# Altium schematic sheet DSP ADAU1451.SchDoc: BULLSEYE
size A3; CompanyName: TYMPHANY; DrawnBy: Yetta.He; Organization: PABU; Address1: 11F,block A, CEC building,; Address2: No.2070 Shennan Zhong road,; Address3: Huaqiang North, Futian District,; Address4: Shenzhen,  Guang Dong, P.R.C 518000; DocumentNumber: 5; Revision: 0.0.5; SheetNumber: 5; SheetTotal: 7; Size: A3; Status: DP1
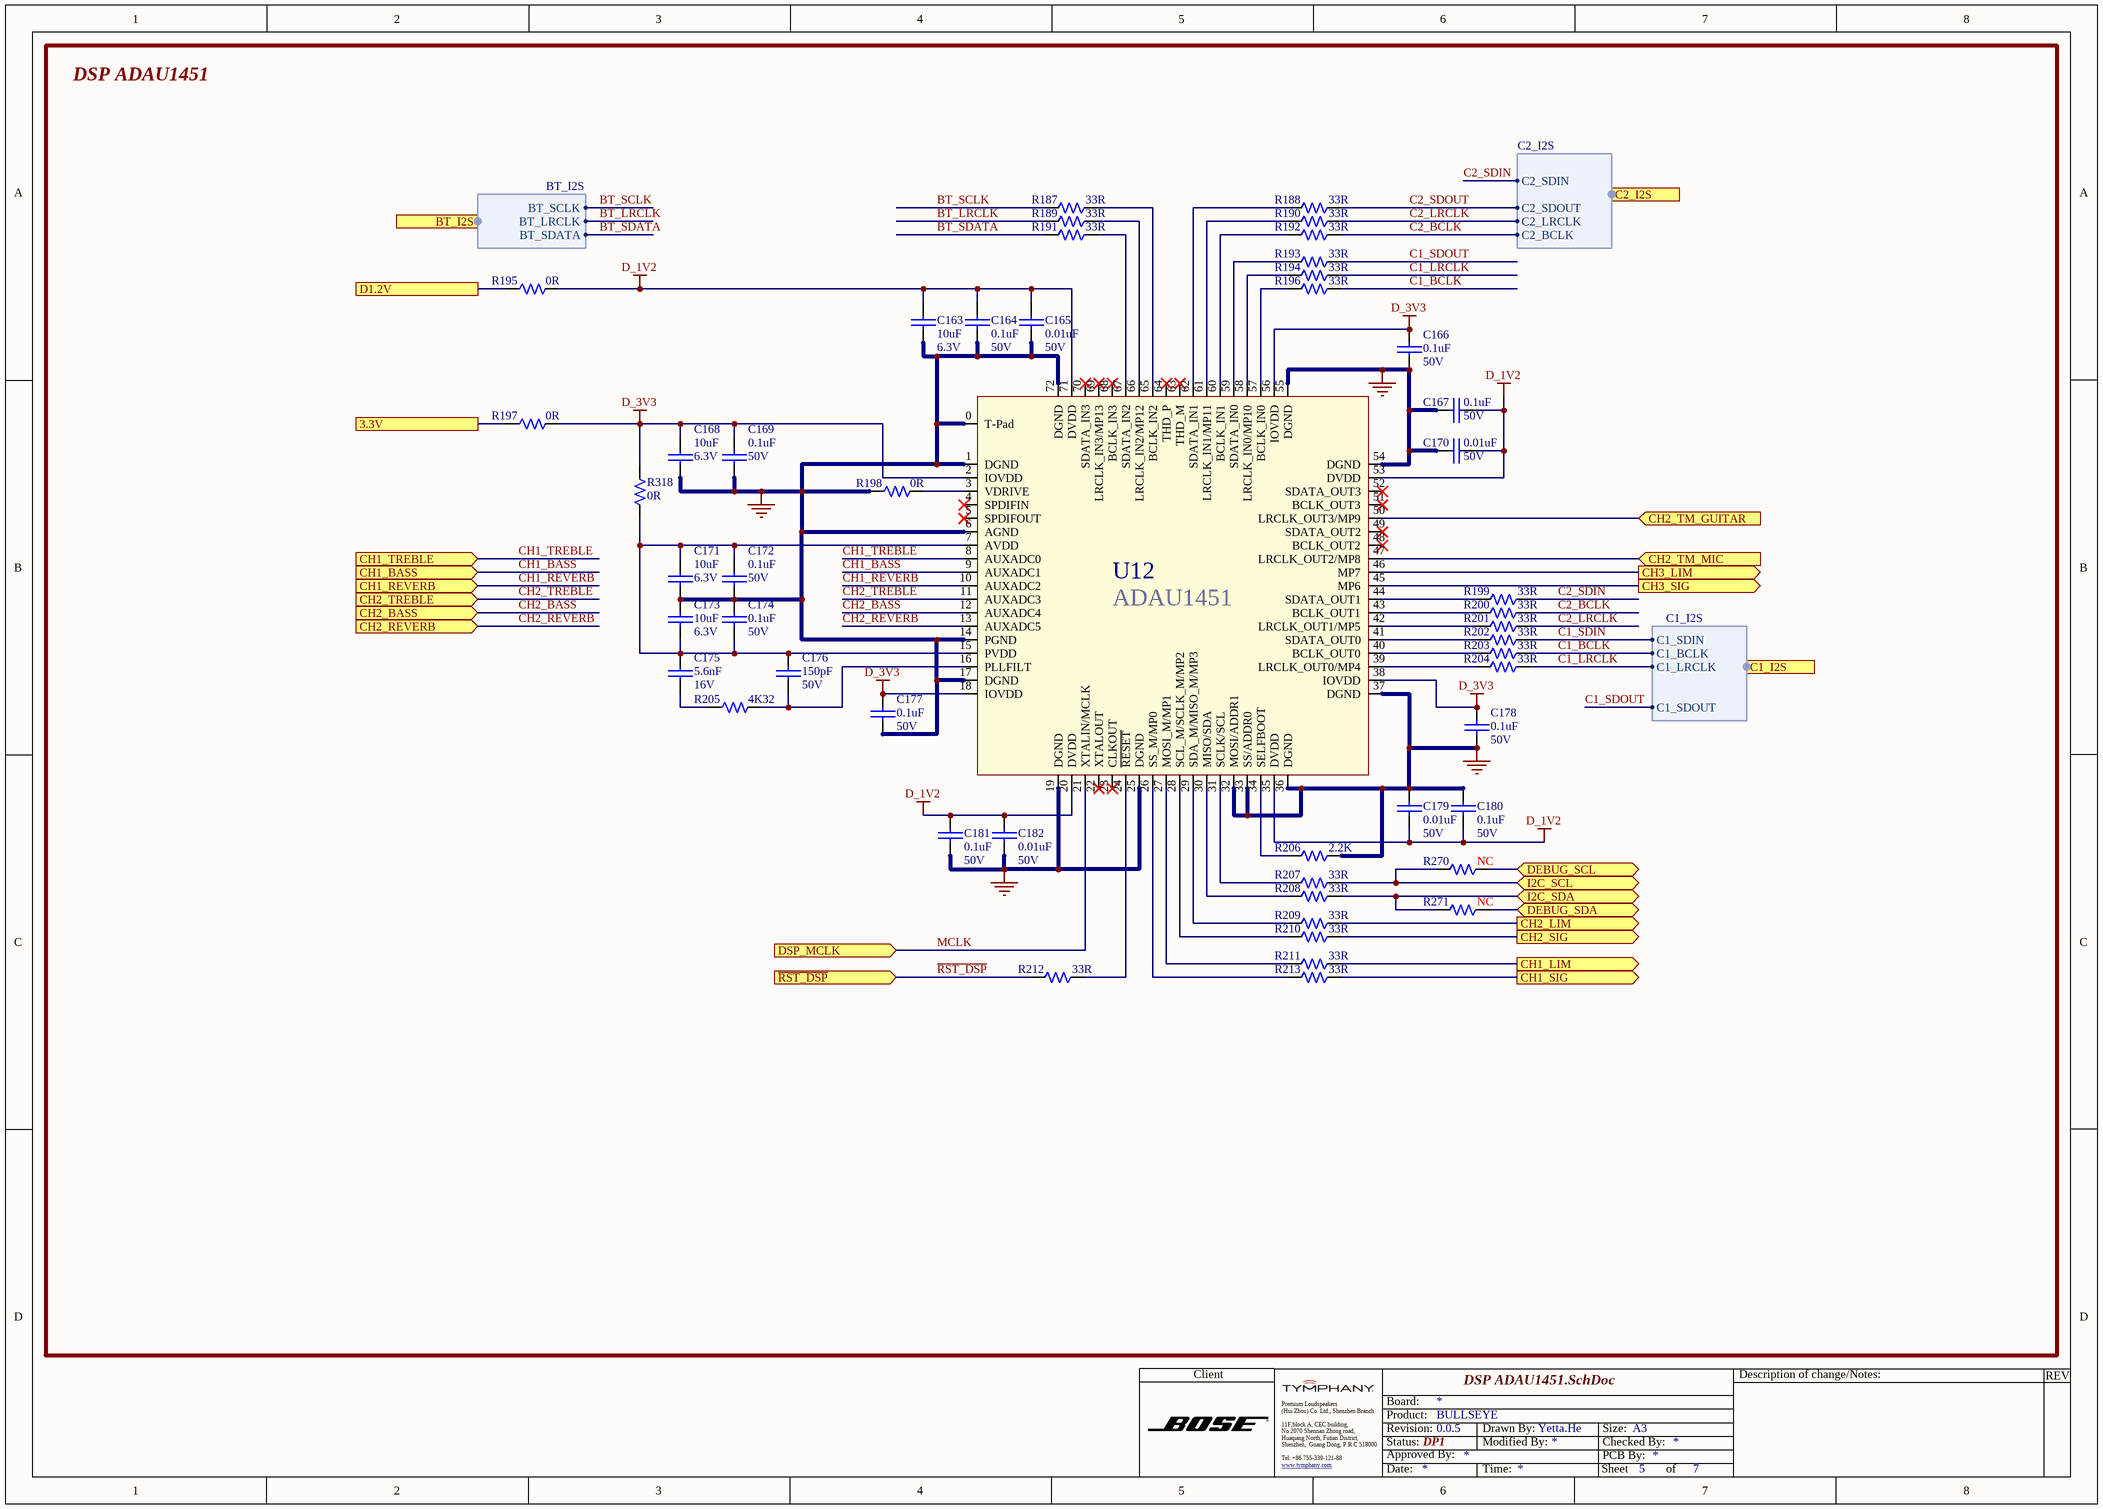
[diagram p0: DSP ADAU1451.SchDoc]

## Parts
C163  value 10uF  Voltage: 6.3V  [CAPC0603-RW]  (hidden comment: T54502106710E)
C164  value 0.1uF  Voltage: 50V  [CAPC0402-RW]  (hidden comment: PWL456470-1040)
C165  value 0.01uF  Voltage: 50V  [CAPC0402-RW]  (hidden comment: PWL456470-1030)
C166  value 0.1uF  Voltage: 50V  [CAPC0402-RW]  (hidden comment: PWL456470-1040)
C167  value 0.1uF  Voltage: 50V  [CAPC0402-RW]  (hidden comment: PWL456470-1040)
C168  value 10uF  Voltage: 6.3V  [CAPC0603-RW]  (hidden comment: T54502106710E)
C169  value 0.1uF  Voltage: 50V  [CAPC0402-RW]  (hidden comment: PWL456470-1040)
C170  value 0.01uF  Voltage: 50V  [CAPC0402-RW]  (hidden comment: PWL456470-1030)
C171  value 10uF  Voltage: 6.3V  [CAPC0603-RW]  (hidden comment: T54502106710E)
C172  value 0.1uF  Voltage: 50V  [CAPC0402-RW]  (hidden comment: PWL456470-1040)
C173  value 10uF  Voltage: 6.3V  [CAPC0603-RW]  (hidden comment: T54502106710E)
C174  value 0.1uF  Voltage: 50V  [CAPC0402-RW]  (hidden comment: PWL456470-1040)
C175  value 5.6nF  Voltage: 16V  [CAPC0402-RW]  (hidden comment: PWL456440-5620)
C176  value 150pF  Voltage: 50V  [CAPC0603-RW]  (hidden comment: T541021516508)
C177  value 0.1uF  Voltage: 50V  [CAPC0402-RW]  (hidden comment: PWL456470-1040)
C178  value 0.1uF  Voltage: 50V  [CAPC0402-RW]  (hidden comment: PWL456470-1040)
C179  value 0.01uF  Voltage: 50V  [CAPC0402-RW]  (hidden comment: PWL456470-1030)
C180  value 0.1uF  Voltage: 50V  [CAPC0402-RW]  (hidden comment: PWL456470-1040)
C181  value 0.1uF  Voltage: 50V  [CAPC0402-RW]  (hidden comment: PWL456470-1040)
C182  value 0.01uF  Voltage: 50V  [CAPC0402-RW]  (hidden comment: PWL456470-1030)
R187  value 33R  [0402-RW]  (hidden comment: QCF161241-3309)
R188  value 33R  [0402-RW]  (hidden comment: QCF161241-3309)
R189  value 33R  [0402-RW]  (hidden comment: QCF161241-3309)
R190  value 33R  [0402-RW]  (hidden comment: QCF161241-3309)
R191  value 33R  [0402-RW]  (hidden comment: QCF161241-3309)
R192  value 33R  [0402-RW]  (hidden comment: QCF161241-3309)
R193  value 33R  [0402-RW]  (hidden comment: QCF161241-3309)
R194  value 33R  [0402-RW]  (hidden comment: QCF161241-3309)
R195  value 0R  [0603-RW]  (hidden comment: T502000002009)
R196  value 33R  [0402-RW]  (hidden comment: QCF161241-3309)
R197  value 0R  [0603-RW]  (hidden comment: T502000002009)
R198  value 0R  [0603-RW]  (hidden comment: T502000002009)
R199  value 33R  [0402-RW]  (hidden comment: QCF161241-3309)
R200  value 33R  [0402-RW]  (hidden comment: QCF161241-3309)
R201  value 33R  [0402-RW]  (hidden comment: QCF161241-3309)
R202  value 33R  [0402-RW]  (hidden comment: QCF161241-3309)
R203  value 33R  [0402-RW]  (hidden comment: QCF161241-3309)
R204  value 33R  [0402-RW]  (hidden comment: QCF161241-3309)
R205  value 4K32  [0402-RW]  (hidden comment: T502432101399)
R206  value 2.2K  [0603-RW]  (hidden comment: QCF011030-2201)
R207  value 33R  [0402-RW]  (hidden comment: QCF161241-3309)
R208  value 33R  [0402-RW]  (hidden comment: QCF161241-3309)
R209  value 33R  [0402-RW]  (hidden comment: QCF161241-3309)
R210  value 33R  [0402-RW]  (hidden comment: QCF161241-3309)
R211  value 33R  [0402-RW]  (hidden comment: QCF161241-3309)
R212  value 33R  [0402-RW]  (hidden comment: QCF161241-3309)
R213  value 33R  [0402-RW]  (hidden comment: QCF161241-3309)
R270  value NC  [0603-RW]  (hidden comment: RES0603 NC)
R271  value NC  [0603-RW]  (hidden comment: RES0603 NC)
R318  value 0R  [0603-RW]  (hidden comment: T502000002009)
U12  T610000050936  [QFN50P1000X1000X100-72N]  (value not drawn)

## Ports
3.3V, BT_I2S (out, harness BT_I2S), C1_I2S (in, harness C1_I2S), C2_I2S (in, harness C2_I2S), CH1_BASS (in), CH1_LIM (out), CH1_REVERB (in), CH1_SIG (out), CH1_TREBLE (in), CH2_BASS (in), CH2_LIM (out), CH2_REVERB (in), CH2_SIG (out), CH2_TM_GUITAR (in), CH2_TM_MIC (in), CH2_TREBLE (in), CH3_LIM (out), CH3_SIG (out), D1.2V, DEBUG_SCL (bidir), DEBUG_SDA (bidir), DSP_MCLK (in), I2C_SCL (bidir), I2C_SDA (bidir), ~{RST_DSP} (in)

## Harnesses
BT_I2S: BT_SDATA, BT_SCLK, BT_LRCLK
C2_I2S: C2_SDOUT, C2_SDIN, C2_BCLK, C2_LRCLK
C1_I2S: C1_SDOUT, C1_SDIN, C1_BCLK, C1_LRCLK

## Nets
D_1V2: C163.1 C164.1 C165.1 C167.2 C170.2 C179.2 C180.2 C181.1 C182.1 R195.2 U12.20(DVDD) U12.35(DVDD) U12.53(DVDD) U12.71(DVDD)
D_3V3: C166.1 C168.1 C169.1 C177.1 C178.1 R197.2 R318.1 U12.2(IOVDD) U12.18(IOVDD) U12.38(IOVDD) U12.56(IOVDD)
GND: C163.2 C164.2 C165.2 C166.2 C167.1 C168.2 C169.2 C170.1 C171.2 C172.2 C173.1 C174.1 C177.2 C178.2 C179.1 C180.1 C181.2 C182.2 R198.1 R206.1 U12.0(T-Pad) U12.1(DGND) U12.6(AGND) U12.14(PGND) U12.17(DGND) U12.19(DGND) U12.25(DGND) U12.32(MOSI/ADDR1) U12.33(SS/ADDR0) U12.36(DGND) U12.37(DGND) U12.54(DGND) U12.55(DGND) U12.72(DGND)
3.3V: R197.1 ; port 3.3V
BT_LRCLK: R189.2 ; port BT_I2S.BT_LRCLK
BT_SCLK: R187.2 ; port BT_I2S.BT_SCLK
BT_SDATA: R191.2 ; port BT_I2S.BT_SDATA
C1_BCLK: R196.1 R203.1 ; port C1_I2S.C1_BCLK
C1_LRCLK: R194.1 R204.1 ; port C1_I2S.C1_LRCLK
C1_SDIN: R202.1 ; port C1_I2S.C1_SDIN
C1_SDOUT: R193.1 ; port C1_I2S.C1_SDOUT
C2_BCLK: R192.1 R200.1 ; port C2_I2S.C2_BCLK
C2_LRCLK: R190.1 R201.1 ; port C2_I2S.C2_LRCLK
C2_SDIN: R199.1 ; port C2_I2S.C2_SDIN
C2_SDOUT: R188.1 ; port C2_I2S.C2_SDOUT
CH1_BASS: U12.9(AUXADC1) ; port CH1_BASS
CH1_LIM: R211.1 ; port CH1_LIM
CH1_REVERB: U12.10(AUXADC2) ; port CH1_REVERB
CH1_SIG: R213.1 ; port CH1_SIG
CH1_TREBLE: U12.8(AUXADC0) ; port CH1_TREBLE
CH2_BASS: U12.12(AUXADC4) ; port CH2_BASS
CH2_LIM: R209.1 ; port CH2_LIM
CH2_REVERB: U12.13(AUXADC5) ; port CH2_REVERB
CH2_SIG: R210.1 ; port CH2_SIG
CH2_TM_GUITAR: U12.50(LRCLK_OUT3/MP9) ; port CH2_TM_GUITAR
CH2_TM_MIC: U12.47(LRCLK_OUT2/MP8) ; port CH2_TM_MIC
CH2_TREBLE: U12.11(AUXADC3) ; port CH2_TREBLE
CH3_LIM: U12.46(MP7) ; port CH3_LIM
CH3_SIG: U12.45(MP6) ; port CH3_SIG
D1.2V: R195.1 ; port D1.2V
DEBUG_SCL: R270.1 ; port DEBUG_SCL
DEBUG_SDA: R271.1 ; port DEBUG_SDA
I2C_SCL: R207.1 R270.2 ; port I2C_SCL
I2C_SDA: R208.1 R271.2 ; port I2C_SDA
MCLK: U12.21(XTALIN/MCLK) ; port DSP_MCLK
~{RST_DSP}: R212.2 ; port ~{RST_DSP}
NetC171_1: C171.1 C172.1 C173.2 C174.2 C175.1 C176.1 R318.2 U12.7(AVDD) U12.15(PVDD)
NetC175_2: C175.2 R205.1
NetC176_2: C176.2 R205.2 U12.16(PLLFILT)
NetR187_1: R187.1 U12.65(BCLK_IN2)
NetR188_2: R188.2 U12.62(SDATA_IN1)
NetR189_1: R189.1 U12.66(LRCLK_IN2/MP12)
NetR190_2: R190.2 U12.61(LRCLK_IN1/MP11)
NetR191_1: R191.1 U12.67(SDATA_IN2)
NetR192_2: R192.2 U12.60(BCLK_IN1)
NetR193_2: R193.2 U12.59(SDATA_IN0)
NetR194_2: R194.2 U12.58(LRCLK_IN0/MP10)
NetR196_2: R196.2 U12.57(BCLK_IN0)
NetR198_2: R198.2 U12.3(VDRIVE)
NetR199_2: R199.2 U12.44(SDATA_OUT1)
NetR200_2: R200.2 U12.43(BCLK_OUT1)
NetR201_2: R201.2 U12.42(LRCLK_OUT1/MP5)
NetR202_2: R202.2 U12.41(SDATA_OUT0)
NetR203_2: R203.2 U12.40(BCLK_OUT0)
NetR204_2: R204.2 U12.39(LRCLK_OUT0/MP4)
NetR206_2: R206.2 U12.34(SELFBOOT)
NetR207_2: R207.2 U12.31(SCLK/SCL)
NetR208_2: R208.2 U12.30(MISO/SDA)
NetR209_2: R209.2 U12.29(SDA_M/MISO_M/MP3)
NetR210_2: R210.2 U12.28(SCL_M/SCLK_M/MP2)
NetR211_2: R211.2 U12.27(MOSI_M/MP1)
NetR212_1: R212.1 U12.24(~{RESET})
NetR213_2: R213.2 U12.26(SS_M/MP0)

Not connected (* = marked no-connect by the designer): U12 4(SPDIFIN)* 5(SPDIFOUT)* 22(XTALOUT)* 23(CLKOUT)* 48(BCLK_OUT2)* 49(SDATA_OUT2)* 51(BCLK_OUT3)* 52(SDATA_OUT3)* 63(THD_M)* 64(THD_P)* 68(BCLK_IN3)* 69(LRCLK_IN3/MP13)* 70(SDATA_IN3)*

## Notes on the sheet
- DSP ADAU1451
- Client
- Description of change/Notes:
- REV
- Premium Loudspeakers
- (Hui Zhou) Co. Ltd., Shenzhen Branch
- Tel: +86 755-339-121-88
- Board:
- Status:
- Revision:
- Product:
- Approved By:
- Drawn By:
- Modified By:
- Checked By:
- PCB By:
- Size:
- www.tymphany.com <http://www.tymphany.com>
- Date:
- Time:
- Sheet
- of

## Library data of the parts
C163 C168 C171 C173 = CAP0603 10uF 6.3V 10%_X5R_SAMSUNG: CAP X5R 10UF 6.3V +-10% 0603 SAMSUN L; MFG Part: CL10A106KQ8NNNC; Tolerance: 10%; Type: Capacitor; CREATE_NAME: Nathan; DIP&SMD: SMD; SAP: T54502106710E; PACKAGE: CAPC0603; Vendor Code: *; Vendor Name: *; MFG: SAMSUNG; Other: X5R; CREATE_TIME: 30-Oct-2018; Customer Specific: N/A
C164 C166 C167 C169 C172 C174 C177 C178 C180 C181 = CAP0402 0.1uF 50V 10%: CAP X7R .10UF 50V +-10% 0402 WALSIN L; SAP: T542011047508; Tolerance: 10%; Type: Capacitor; CREATE_NAME: TOM@Deftronics; DIP&SMD: SMD; PACKAGE: CAPC0402; Vendor Name: *; MFG: *; MFG Part: *; Other: X7R; CREATE_TIME: 13-May-2014; Customer Specific: N/A
C165 C170 C179 C182 = CAP0402 0.01uF 50V 10%: CAP, CER, 0.01uF, 10%, 50V, X7R, 0402, RoHS; SAP: T542011037508; Type: Capacitor; CREATE_NAME: Evan@Deftronics; DIP&SMD: SMD; PACKAGE: CAPC0402; Vendor Name: *; MFG: *; MFG Part: *; Other: X7R; Tolerance: 10%; CREATE_TIME: 26-May-2014; Customer Specific: N/A
C175 = CAP0402 5.6nF 16V 10%: CHIP CAP 10% 16V 0402 X7R  5.6nF; SAP: T542015627308; Vendor Name: 华新科技股份有限公司; MFG: Walsin; Type: Capacitor; DIP&SMD: SMD; PACKAGE: CAPC0402; MFG Part: *; Other: X7R; Tolerance: 10%; Customer Specific: N/A
C176 = CAP0603 150pF 50V 5%_NPO_WALSIN: CAP NPO 150PF 50V +-5% 0603 WALSIN L; Tolerance: 5%; Type: Capacitor; DIP&SMD: SMD; CREATE_NAME: Nathan; SAP: T541021516508; PACKAGE: CAPC0603; Vendor Name: *; MFG: WALSIN; MFG Part: *; Other: NPO; Customer Specific: N/A; CREATE_TIME: 13-July-2016
R187-R194 R196 R199-R204 R207-R213 = RES0402 1/16W 1% 33 OHM: CHIP RES 33 OHM 1/16W 1% 0402; SAP: T502330A01399; MFG: WALSIN; DIP&SMD: SMD; Vendor Code: *; Power: 1/16W; Vendor Name: *; MFG Part: *; TOL: 1%; Type: Resistor; PACKAGE: 0402; Customer Specific: N/A
R195 R197 R198 R318 = RES0603 1/10W 0 OHM_WALSIN: CHIP 0 OHM 0 OHM 0 OHM 0603 WALSIN L; MFG Part: WR06X000PTL; Power: 1/10W; MFG: WALSIN (華新); DIP&SMD: SMD; Vendor Code: *; SAP: T502000002009; Vendor Name: *; TOL: *; Type: Resistor; PACKAGE: 0603; Customer Specific: N/A
R205 = RES0402 1/16W 1% 4.32K OMH_WALSIN: CHIP 4.32K OHM 100PPM +-1% 0402 WALS L; TOL: 1%; MFG: WALSIN (華新); Power: 1/16W; CREATE_NAME: Nathan; DIP&SMD: SMD; SAP: T502432101399; Package: 0402; MFG Part: *; Vendor Code: *; Vendor Name: *; Type: Resistor; CREATE_TIME: 25-May-2016; Customer Specific: N/A
R206 = RES0603 1/10W 1% 2.2K OHM: GP CHIP RES. 2.2K OHM 1/10W 1% 0603; Vendor Code: 10010262; SAP: T502220102399; Vendor Name: 东莞市晴远电子有限公司; DIP&SMD: SMD; Power: 1/10W; MFG Part: *; MFG: *; TOL: 1%; Type: Resistor; PACKAGE: 0603; Customer Specific: N/A
R270 R271 = RES0603 NC: NC; CREATE_NAME: Tom; DIP&SMD: SMD; SAP: *; Tolerance: *; MFG Part: *; MFG: *; Vendor Code: *; Vendor Name: *; Type: Resistor; Power: *; CREATE_TIME: 18-Mar-2016; Customer Specific: N/A; Package: 0603
U12 = ADAU1451: SP ADAU1451 LFCSP-72 ADI (AN K; MFG: ADI (ANALOG DEVICES); CREATE_NAME: Tom; DIP&SMD: SMD; SAP: T610000050936; Vendor Name: *; Vendor Code: *; Package: LFCSP-72; CREATE_TIME: 27-Oct-2015; Type: IC; Customer Specific: N/A; MFG Part: ADAU1451